# EAGLE design Emat_300v (EAGLE 9.2.2)
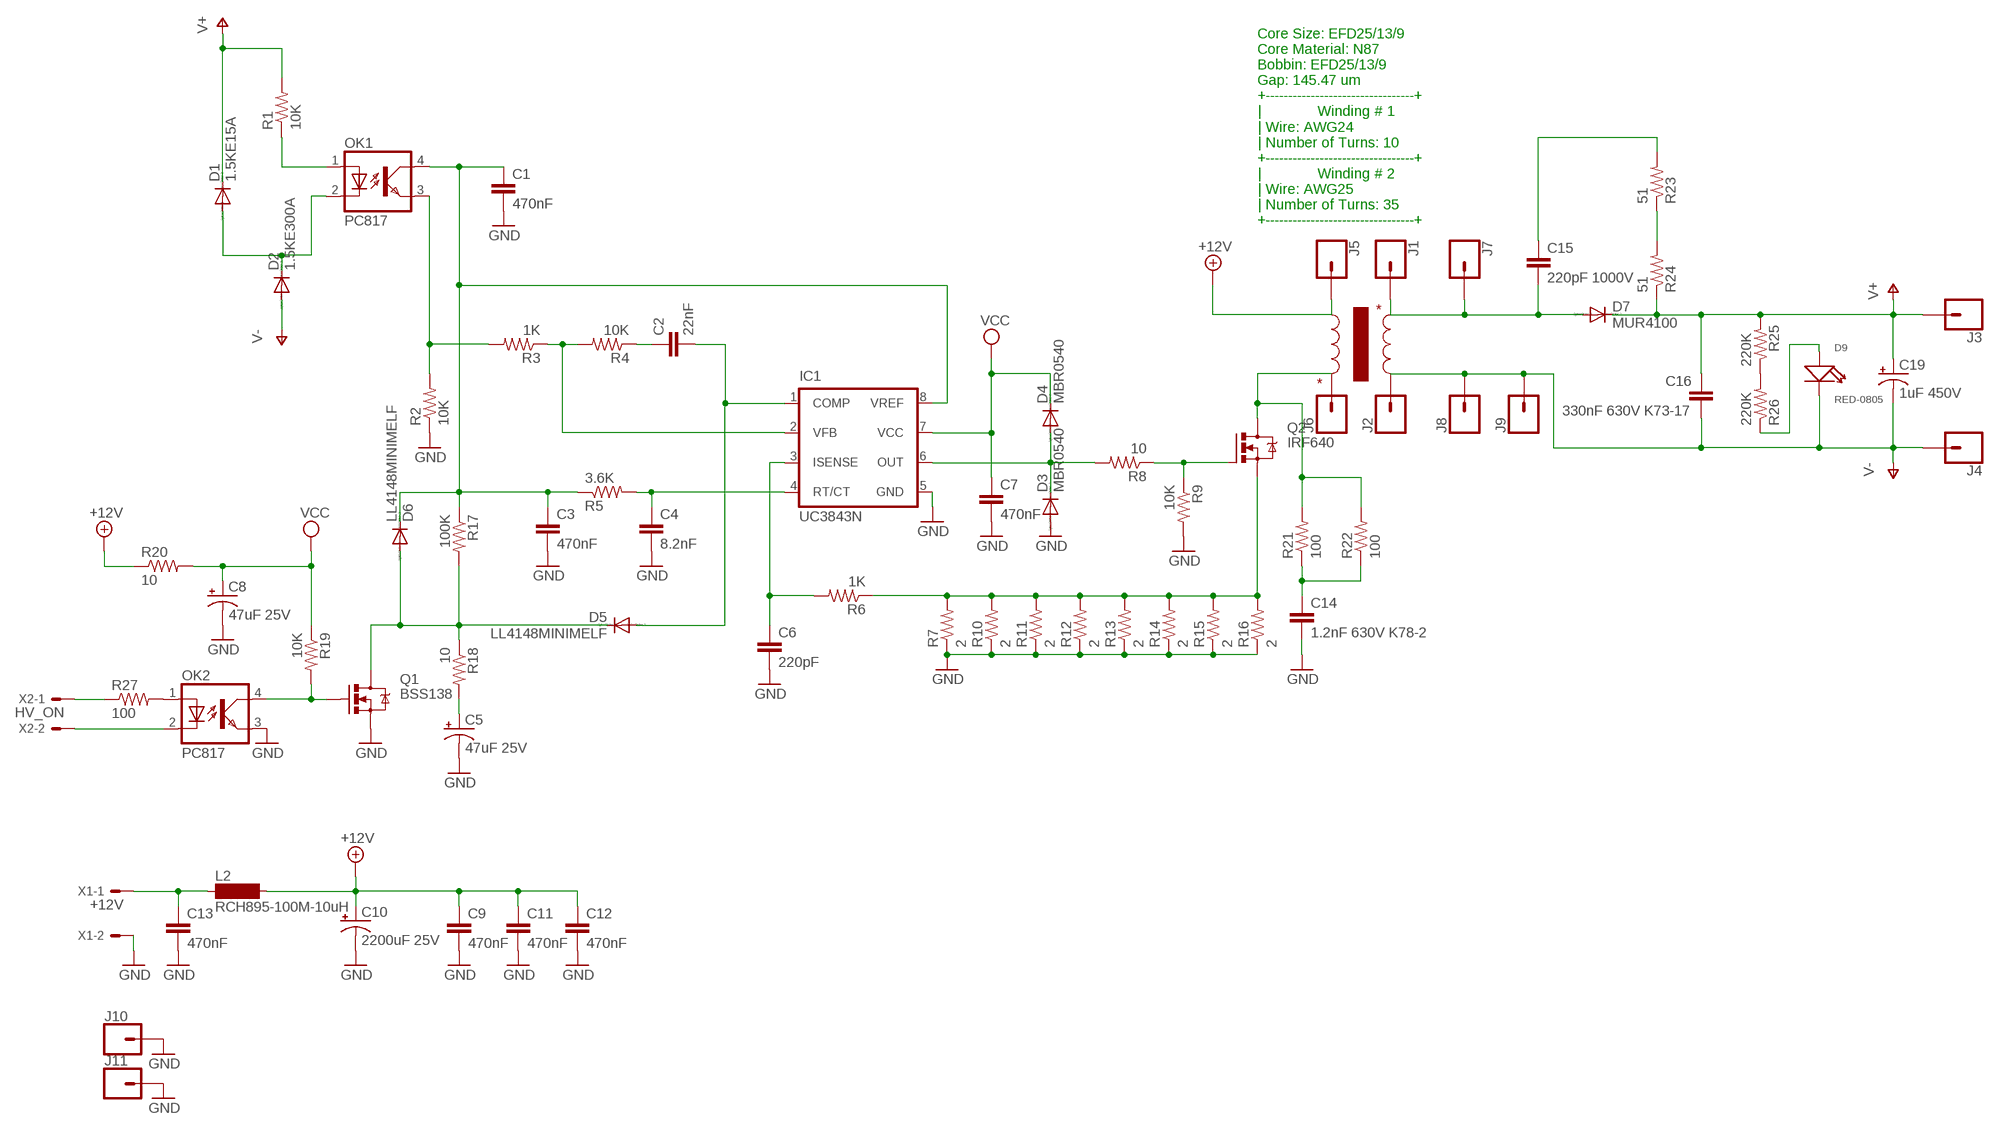
[diagram p0: schematic, sheet 1]

## Parts
C1  470nF  C-EUC0805  [C0805]
C2  22nF  C-EUC0805  [C0805]
C3  470nF  C-EUC0805  [C0805]
C4  8.2nF  C-EUC0805  [C0805]
C5  47uF 25V  CPOL-USE5-8.5  [E5-8,5]
C6  220pF  C-EUC0805  [C0805]
C7  470nF  C-EUC0805  [C0805]
C8  47uF 25V  CPOL-USE5-8.5  [E5-8,5]
C9  470nF  C-EUC0805  [C0805]
C10  2200uF 25V  CPOL-USE7.5-18  [E7,5-18]
C11  470nF  C-EUC0805  [C0805]
C12  470nF  C-EUC0805  [C0805]
C13  470nF  C-EUC0805  [C0805]
C14  1.2nF 630V K78-2  C-EU150-064X183  [C150-064X183]
C15  220pF 1000V  C-EU075-042X103  [C075-042X103]
C16  330nF 630V K73-17  C-EU225-062X268  [C225-062X268]
C19  1uF 450V  CPOL-USE5-8.5  [E5-8,5]
D1  1.5KE15A  DIODE-DO201-15  [DO201-15]
D2  1.5KE300A  DIODE-DO201-15  [DO201-15]
D3  MBR0540  DIODE-SOD123  [SOD123]
D4  MBR0540  DIODE-SOD123  [SOD123]
D5  LL4148MINIMELF  [MINIMELF]
D6  LL4148MINIMELF  [MINIMELF]
D7  MUR4100  DIODE-DO201-15  [DO201-15]
D9  RED-0805  SMD-LED-CLEAR-GREEN(0805)  [LED-0805]
IC1  UC3843N  [DIL08]
J1  CONN_01PTH_NO_SILK_KIT  [1X01NS_KIT]
J2  CONN_01PTH_NO_SILK_KIT  [1X01NS_KIT]
J3  CONN_01PTH_NO_SILK_KIT  [1X01NS_KIT]
J4  CONN_01PTH_NO_SILK_KIT  [1X01NS_KIT]
J5  CONN_01PTH_NO_SILK_KIT  [1X01NS_KIT]
J6  CONN_01PTH_NO_SILK_KIT  [1X01NS_KIT]
J7  CONN_01PTH_NO_SILK_KIT  [1X01NS_KIT]
J8  CONN_01PTH_NO_SILK_KIT  [1X01NS_KIT]
J9  CONN_01PTH_NO_SILK_KIT  [1X01NS_KIT]
J10  CONN_01PTH_NO_SILK_KIT  [1X01NS_KIT]
J11  CONN_01PTH_NO_SILK_KIT  [1X01NS_KIT]
L2  RCH895-100M-10uH  RCH-89511  [BS11]
OK1  PC817  [DIL04]
OK2  PC817  [DIL04]
Q1  BSS138  MOSFET-NCHANNELBSS138  [SOT23-3]
Q2  IRF640  [TO220BV]
R1  10K  R-US_R1206  [R1206]
R2  10K  R-US_R1206  [R1206]
R3  1K  R-US_R1206  [R1206]
R4  10K  R-US_R1206  [R1206]
R5  3.6K  R-US_R1206  [R1206]
R6  1K  R-US_R1206  [R1206]
R7  2  R-US_R1206  [R1206]
R8  10  R-US_R1206  [R1206]
R9  10K  R-US_R1206  [R1206]
R10  2  R-US_R1206  [R1206]
R11  2  R-US_R1206  [R1206]
R12  2  R-US_R1206  [R1206]
R13  2  R-US_R1206  [R1206]
R14  2  R-US_R1206  [R1206]
R15  2  R-US_R1206  [R1206]
R16  2  R-US_R1206  [R1206]
R17  100K  R-US_R1206  [R1206]
R18  10  R-US_R1206  [R1206]
R19  10K  R-US_R1206  [R1206]
R20  10  R-US_R1206  [R1206]
R21  100  R-US_R2512  [R2512]
R22  100  R-US_R2512  [R2512]
R23  51  R-US_R1206  [R1206]
R24  51  R-US_R1206  [R1206]
R25  220K  R-US_R1206  [R1206]
R26  220K  R-US_R1206  [R1206]
R27  100  R-US_R1206  [R1206]
X1  +12V  22-23-2021  [22-23-2021]
X2  HV_ON  22-23-2021  [22-23-2021]

## Nets
+12V: C9.1 C10.+ C11.1 C12.1 J5.1 L2.2 R20.1
GND: C1.2 C3.2 C4.2 C5.- C6.2 C7.2 C8.- C9.2 C10.- C11.2 C12.2 C13.2 C14.2 D3.A IC1.5(GND) J10.1 J11.1 OK2.3(EMIT) Q1.2(S) R2.1 R7.1 R9.2 R10.1 R11.1 R12.1 R13.1 R14.1 R15.1 R16.1 X1.2
N$1: D1.A D2.C OK1.2(C)
N$2: R25.1 R26.2
N$3: OK1.1(A) R1.1
N$4: C5.+ R18.2
N$5: OK1.3(EMIT) R2.2 R3.2
N$6: IC1.2(VFB) R3.1 R4.2
N$7: C2.1 R4.1
N$8: C2.2 D5.A IC1.1(COMP)
N$9: C4.1 IC1.4(RT/CT) R5.2
N$10: C6.1 IC1.3(ISENSE) R6.2
N$11: D3.C D4.A IC1.6(OUT) R8.2
N$12: Q2.G R8.1 R9.1
N$13: Q2.S R6.1 R7.2 R10.2 R11.2 R12.2 R13.2 R14.2 R15.2 R16.2
N$14: C1.1 C3.1 D6.C IC1.8(VREF) OK1.4(COL) R5.1 R17.1
N$15: D5.C D6.A Q1.3(D) R17.2 R18.1
N$16: C13.1 L2.1 X1.1
N$17: OK2.4(COL) Q1.1(G) R19.2
N$18: OK2.1(A) R27.2
N$19: OK2.2(C) X2.2
N$20: J6.1 Q2.D R21.2 R22.2
N$21: C14.1 R21.1 R22.1
N$22: C15.2 D7.A J1.1 J7.1
N$23: R27.1 X2.1
N$24: R23.1 R24.2
N$25: C15.1 R23.2
N$27: D9.+ R26.1
V+: C16.1 C19.+ D1.C D7.C J3.1 R1.2 R24.1 R25.2
V-: C16.2 C19.- D2.A D9.- J2.1 J4.1 J8.1 J9.1
VCC: C7.1 C8.+ D4.C IC1.7(VCC) R19.1 R20.2

## Notes on the sheet
- Core Size: EFD25/13/9
  Core Material: N87
  Bobbin: EFD25/13/9
  Gap: 145.47 um
  +---------------------------------+
  |              Winding # 1             
  | Wire: AWG24
  | Number of Turns: 10
  +---------------------------------+
  |              Winding # 2             
  | Wire: AWG25
  | Number of Turns: 35
  +---------------------------------+
- *
- *

## Library data of the parts
C1-C4 C6 C7 C9 C11-C16 = rcl:C-EU: CAPACITOR, European symbol
C5 C8 C10 C19 = rcl:CPOL-US: POLARIZED CAPACITOR, American symbol
D1-D4 D7 = diode:DIODE-: DIODE
D5 D6 = diode:LL4148: DIODE high speed (Philips)
D9 = Seeed-LED:SMD-LED-CLEAR-GREEN(0805): 304090057; MPN: 17-215SYGC/S530-E2/TR8; VALUE: GREEN-0805
IC1 = v-reg:UC384*: SMPS Controller Source: http://www.fairchildsemi.com/ds/UC/UC3843.pdf
J1-J11 = SparkFun-Connectors:CONN_01: Single connection point. Often used as Generic Header-pin footprint for 0.1 inch spaced/style header connections On any of the 0.1 inch spaced packages, you can populate with these: Break Away Headers - Straight <https://www.sparkfun.com/products/116> (PRT-00116) Break Away Male Headers - Right Angle <https://www.sparkfun.com/products/553> (PRT-00553) Female Headers <https://www.sparkfun.com/products/115> (PRT-00115) Break Away Headers - Machine Pin <https://www.sparkfun.com/products/117> (PRT-00117) Break Away Female Headers - Swiss Machine Pin <https://www.sparkfun.com/products/743> (PRT-00743) This device is also useful as a general connection point to wire up your design to another part of your project. Our various solder wires solder well into these plated through hole pads. Hook-Up Wire - Assortment (Stranded, 22 AWG) <https://www.sparkfun.com/products/11375> (PRT-11375) Hook-Up Wire - Assortment (Solid Core, 22 AWG) <https://www.sparkfun.com/products/11367> (PRT-11367) View the entire wire category on our website here <https://www.sparkfun.com/categories/141> Special notes: SMTSO-256-ET is a "flush mount" nut for a 4-40 screw. We mostly use this on specialty testbeds; it is a nice way to connect hardware to your PCB at an adjustable hieght. Also note, the SNAP packages are for using a snappable style connector. We sell a baggie of snaps and they are also used on two LilyPad designs: Snap Assortment - 30 pack (male and female) <https://www.sparkfun.com/products/11347> (DEV-11347) LilyPad Arduino SimpleSnap <https://www.sparkfun.com/products/10941> (DEV-10941) LilyPad SimpleSnap Protoboard <https://www.sparkfun.com/products/10940> (DEV-10940)
L2 = inductor-neosid:RCH-895: INDUCTOR nominal inductance, magnetically screened; OC_FARNELL: unknown; OC_NEWARK: unknown
OK1 OK2 = optocoupler:PC817: SHARP OPTO COUPLER; MPN: PC817X4J000F; OC_FARNELL: 9707727; OC_NEWARK: 97K7059
Q1 = SparkFun-DiscreteSemi:MOSFET-NCHANNEL: Common NMOSFET Parts MFG P/N Store ID Prod ID FDD8780 TRANS-09984 SI7820DN TRANS-11055 FDS6630A IC-08089 2N7002PW TRANS-11151 FQP30N06L COM-10213 TRANS-10060 BSS123LT1G TRANS-08345 BSS138 TRANS-00830 BS170 2N7000; PROD_ID: TRANS-00830; VALUE: 200mA/50V
Q2 = transistor-power:IRF640: HEXFET Power MOSFET
R1-R27 = resistor:R-US_: RESISTOR, American symbol
X1 X2 = con-molex:22-23-2021: .100" (2.54mm) Center Header - 2 Pin; MF: MOLEX; MPN: 22-23-2021; OC_FARNELL: 1462926; OC_NEWARK: 25C3832

## Net classes
0 default: width 0.3 mm, drill 0.3 mm, clearance 0.3 mm

## Board
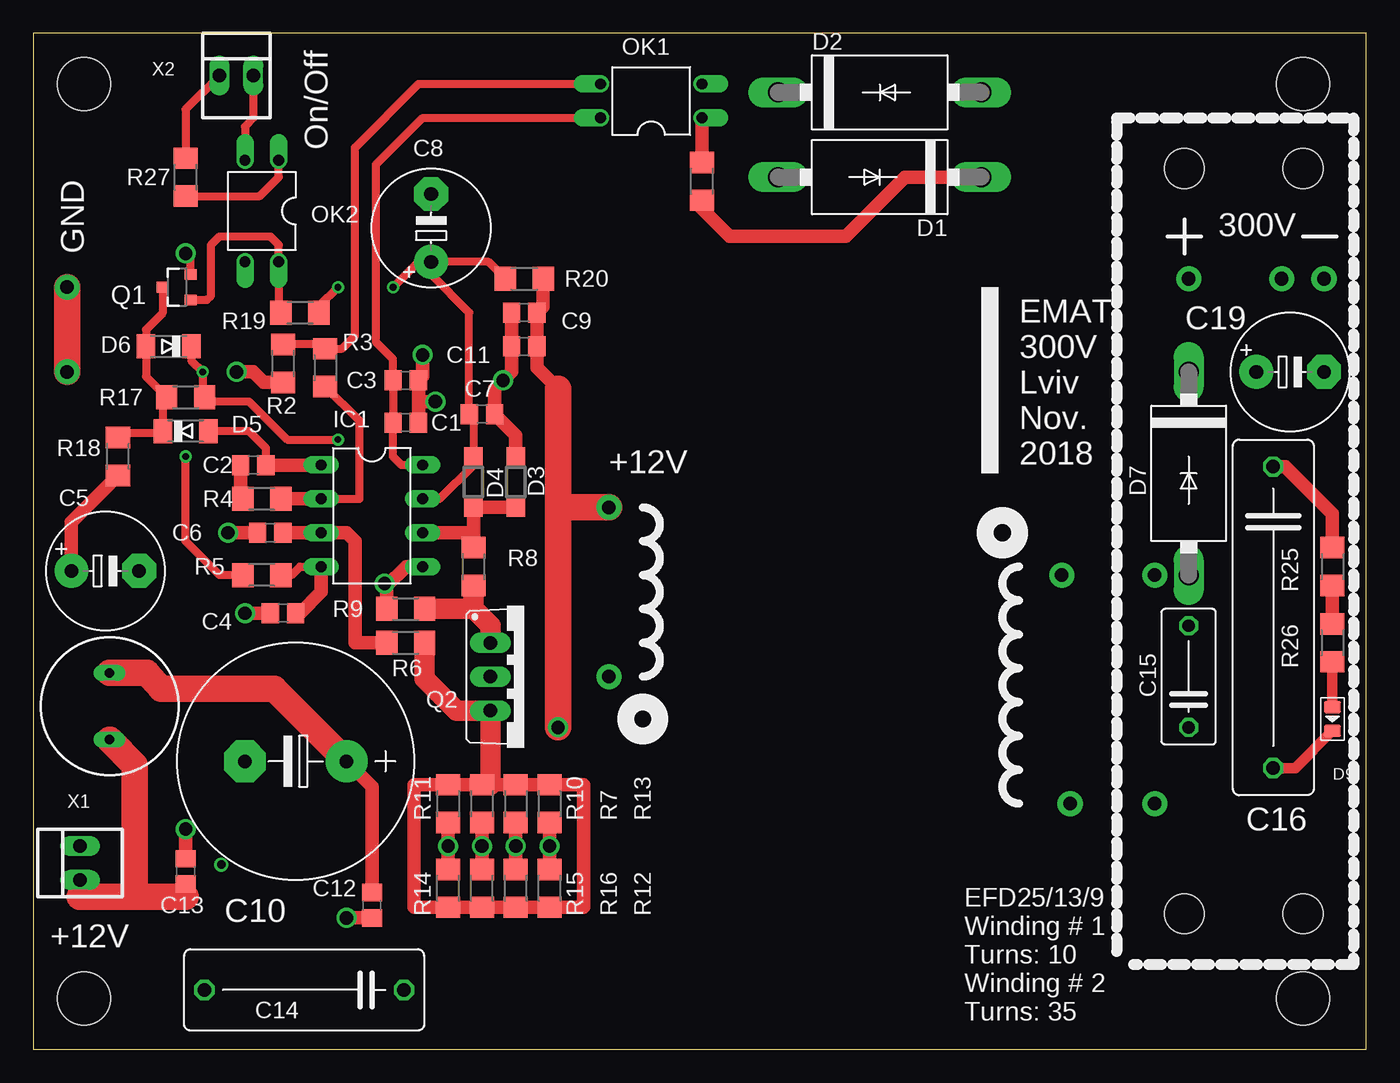
[diagram p1: board, top side]
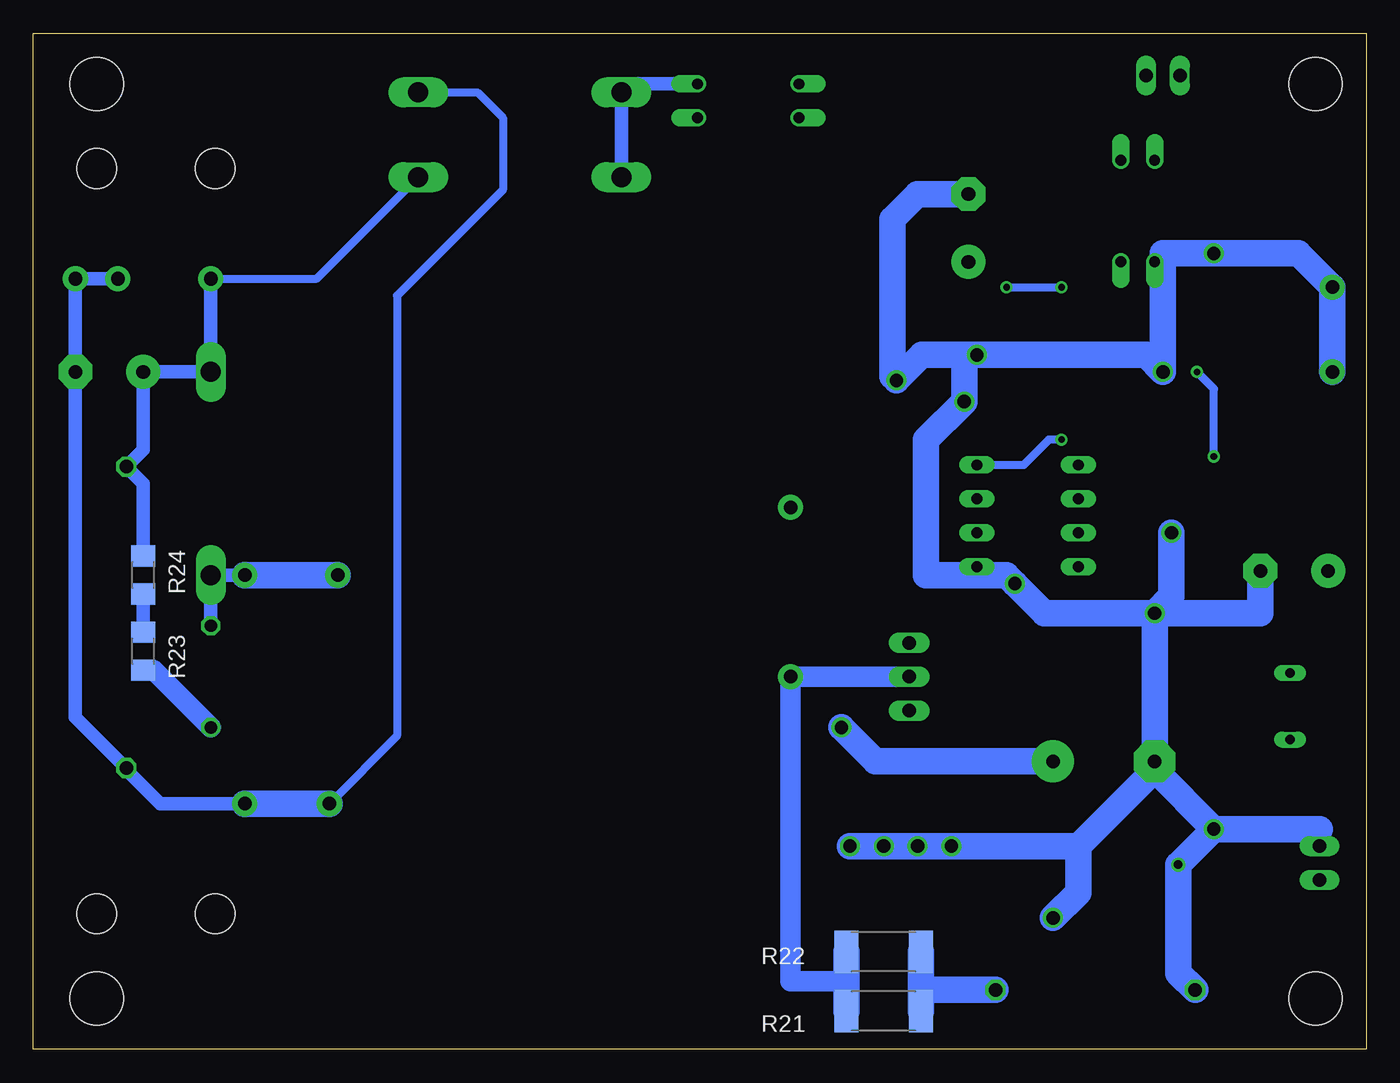
[diagram p2: board, bottom side, seen from below]

Size 100 x 76.19 mm. Coordinates in mm from the lower left corner, seen from the top.
Outline: 0,0 100,0 100,76.19 0,76.19 0,0
Copper layers (1*16): Top 0.035mm / dielectric 1.5mm / Bottom 0.035mm
Design rules "default *": minimum track width 10mil, minimum drill 25mil, track to track 20mil, track to pad 20mil, pad to pad 8mil, via to via 8mil, smd to smd 8mil, copper to edge 40mil, drill to drill 8mil, minimum pad ring 10mil, minimum via ring 8mil, stop-mask expansion 4mil, vias tented up to drill 0mil, thermal gap 10mil
Holes 4 mm at 95.25,72.39 95.25,3.81 3.81,3.81 3.81,72.39
Holes 3 mm at 95.25,10.16 86.36,10.16 95.25,66.04 86.36,66.04

### Footprints (pad centres in the part's own frame; a part is rotated, then mirrored left to right if it is on the bottom)
C0805 = smd 1.3 x 1.5: 1 -0.95,0; 2 0.95,0
E5-8,5 = drill 1.016 pad 2.54: + -2.54,0 | drill 1.016 pad 2.54 octagon: - 2.54,0
E7,5-18 = drill 1.016 pad 3.15: + -3.81,0 | drill 1.016 pad 3.15 octagon: - 3.81,0
C150-064X183 = drill 1.016 octagon: 1 -7.493,0; 2 7.493,0
C075-042X103 = drill 0.914 octagon: 1 -3.81,0; 2 3.81,0
C225-062X268 = drill 1.016 octagon: 1 -11.303,0; 2 11.303,0
DO201-15 = drill 1.499 long: A 7.62,0; C -7.62,0
SOD123 = smd 1.4 x 1.4: A 1.9,0; C -1.9,0
MINIMELF = smd 1.4 x 1.8: A 1.7,0; C -1.7,0
LED-0805 = smd 0.889 x 1.27: + -0.889,0; - 0.889,0
DIL08 = drill 0.813 long: 1 -3.81,-3.81; 2 -1.27,-3.81; 3 1.27,-3.81; 4 3.81,-3.81; 5 3.81,3.81; 6 1.27,3.81; 7 -1.27,3.81; 8 -3.81,3.81
1X01NS_KIT = drill 1.016 pad 1.88: 1 0,0
BS11 = drill 0.7 long: 1 -2.5,0; 2 2.5,0
DIL04 = drill 0.813 offset: 1 -1.27,-3.81; 2 1.27,-3.81; 3 1.27,3.81; 4 -1.27,3.81
SOT23-3 = smd 0.8 x 0.9: 1 -0.95,-1; 2 0.95,-1; 3 0,1.1
TO220BV = drill 1.016 long: D 0,-2.54; G -2.54,-2.54; S 2.54,-2.54
R1206 = smd 1.6 x 1.803: 1 -1.422,0; 2 1.422,0
R2512 = smd 1.8 x 3.2: 1 -2.8,0; 2 2.8,0
22-23-2021 = drill 1 long: 1 -1.27,0; 2 1.27,0

### Placement (x,y rotation side)
C1  27.94,46.99 0 top
C2  16.51,43.81 0 top
C3  27.94,50.16 0 top
C4  18.73,32.7 180 top
C5  5.4,35.88 0 top
C6  17.78,38.73 180 top
C7  33.66,47.62 0 top
C8  29.84,61.59 90 top
C9  36.83,55.24 180 top
C10  19.68,21.59 180 top
C11  36.83,52.7 180 top
C12  25.4,10.79 270 top
C13  11.43,13.34 90 top
C14  20.32,4.45 180 top
C15  86.68,27.94 90 top
C16  93.03,32.38 270 top
C19  94.3,50.8 0 top
D1  63.5,65.41 180 top
D2  63.5,71.75 0 top
D3  36.2,42.55 90 top
D4  33.02,42.55 270 top
D5  11.43,46.35 0 top
D6  10.16,52.7 180 top
D7  86.68,43.18 270 top
D9  97.47,24.77 270 top
IC1  25.4,40.01 270 top
J1  77.15,35.56 0 top
J2  77.79,18.41 0 top
J3  86.68,57.78 0 top
J4  96.84,57.78 0 top
J5  43.18,40.64 0 top
J6  43.18,27.94 0 top
J7  84.14,35.56 0 top
J8  84.14,18.41 0 top
J9  93.66,57.78 0 top
J10  2.54,50.8 0 top
J11  2.54,57.15 0 top
L2  5.71,25.72 90 top
OK1  46.35,71.12 90 top
OK2  17.14,62.87 180 top
Q1  10.79,57.15 90 top
Q2  36.83,27.94 270 top
R1  50.16,65.09 270 top
R2  18.73,51.44 90 top
R3  21.91,51.12 90 top
R4  17.14,41.27 0 top
R5  17.14,35.56 0 top
R6  27.94,30.48 180 top
R7  36.2,18.41 90 top
R8  33.02,36.2 90 top
R9  27.94,33.02 180 top
R10  33.66,18.41 90 top
R11  31.11,18.41 90 top
R12  38.73,12.06 270 top
R13  38.73,18.41 90 top
R14  31.11,12.06 270 top
R15  33.66,12.06 270 top
R16  36.2,12.06 270 top
R17  11.43,48.9 180 top
R18  6.35,44.45 270 top
R19  20,55.24 180 top
R20  36.83,57.78 180 top
R21  36.2,2.86 180 bottom
R22  36.2,7.3 180 bottom
R23  91.76,29.84 270 bottom
R24  91.76,35.56 270 bottom
R25  97.47,36.2 90 top
R26  97.47,30.48 90 top
R27  11.43,65.41 270 top
X1  3.49,13.97 90 top
X2  15.24,73.03 0 top

### Tracks (layer width: path | path; a pad name or v marks a point on that pad's centre or on a via)
+12V  (via drill 1)
  Top 1: 39.37,49.53 37.78,51.12 C11.1 C9.1 38.25,55.72 R20.1
  Top 1.016: C12.1 25.4,19.68 C10.+
  Top 2: L2.2 8.52,28.22 9.61,27.03 18.06,27.03 C10.+ | v39.37,24.13 39.37,40.64 | 39.37,40.64 39.37,49.53 | 39.37,40.64 J5.1
  Bottom 2: C10.+ 36.83,21.59 v39.37,24.13
GND  (via drill 0.64, 1)
  Top 0.61: Q1.2 11.79,59.33 v11.43,59.69
  Top 1: C9.2 C11.2 35.88,50.8 v35.24,50.16 34.6,49.53 C7.2 36.2,46.03 D3.A | C1.2 C3.2 29.21,50.48 v29.21,52.07 | R2.1 17.3,50.01 16.51,50.8 v15.24,50.8 | R11.1 v31.11,15.24 R14.1 | R10.1 v33.66,15.24 R15.1 | R7.1 v36.2,15.24 R16.1 | R13.1 v38.73,15.24 R12.1
  Top 1.016: v11.43,16.51 C13.2 | R9.2 26.52,34.76 | 26.52,34.76 v26.35,34.92 | IC1.5 27.95,36.2 26.52,34.76 | C4.2 v15.88,32.7 | C6.2 v14.61,38.73 | v30.16,48.58 28.89,48.58 C3.2 | C12.2 v23.5,9.85 v23.5,9.84
  Top 2: J11.1 J10.1
  Bottom 0.61: OK2.3 15.24,59.05 15.24,59.69
  Bottom 1.016: X1.2 3.49,16.51
  Bottom 2: v29.21,52.07 33.34,52.07 v35.24,50.16 35.56,50.48 35.56,62.23 33.66,64.14 C8.- | v29.21,52.07 16.51,52.07 v15.24,50.8 15.24,59.05 | 21.59,15.24 v31.11,15.24 v33.66,15.24 v36.2,15.24 v38.73,15.24 | 3.49,16.51 v11.43,16.51 | v11.43,16.51 v14.1,13.84 14.1,5.71 C14.2 | v11.43,16.51 15.88,20.95 | 15.88,20.95 C10.- v15.88,32.7 | 15.88,20.95 21.59,15.24 | v15.88,32.7 24.13,32.7 v26.35,34.92 26.99,35.56 33.02,35.56 33.02,45.72 v30.16,48.58 30.16,52.07 v29.21,52.07 | v14.61,38.73 14.61,33.97 v15.88,32.7 | 21.59,15.24 21.59,11.75 v23.5,9.84 | 15.24,59.69 v11.43,59.69 5.08,59.69 J11.1 J10.1 | C5.- 7.94,32.7 v15.88,32.7
N$1
  Bottom 1.016: D1.A D2.C 55.24,72.39 OK1.2
N$2
  Top 1: R25.1 R26.2
N$3
  Top 1.016: OK1.1 R1.1
N$4
  Top 1.016: R18.2 2.86,39.53 C5.+
N$5
  Top 0.61: R2.2 21.59,52.86 R3.2 23.18,52.54 24.13,53.49 24.13,67.63 28.89,72.39 OK1.3
N$6
  Top 0.61: IC1.2 24.45,41.27 24.45,47.16 R3.1
  Top 1.016: R4.2 IC1.2
N$7
  Top 1.016: C2.1 15.56,41.44 R4.1
N$8
  Top 0.61: C2.2 17.46,45.09 16.19,46.35 D5.A
  Top 1.016: IC1.1 C2.2
N$9
  Top 0.61: R5.2 19.37,35.56 20,36.2 IC1.4
  Top 1.016: IC1.4 21.59,34.29 20,32.7 C4.1
N$10
  Top 1.016: R6.2 24.13,30.48 24.13,38.1 23.5,38.73 IC1.3 C6.1
N$11
  Top 1.016: IC1.6 33.02,38.73 R8.2 D4.A D3.C
N$12
  Top 1.524: 33.02,33.02 R8.1 | R9.1 33.02,33.02 | 33.02,33.02 34.29,31.75 Q2.G
N$13
  Top 1.016: R11.2 R10.2 34.29,19.84 R7.2 R13.2 41.27,19.84 41.27,10.64 R12.2 R16.2 R15.2 R14.2 28.57,10.64 28.57,19.84 R11.2
  Top 1.524: 34.29,19.84 Q2.S 31.75,25.4 29.36,27.79 R6.1
N$14  (via drill 0.5)
  Top 0.61: IC1.8 27.62,43.81 26.99,44.45 C1.1 C3.1 26.99,51.75 25.72,53.02 25.72,66.36 29.21,69.85 OK1.4 | R5.1 13.97,35.56 11.43,38.1 v11.43,44.45 | D6.C 11.86,51.64 v12.7,50.8 12.7,49.05 R17.1 13.17,48.58 16.19,48.58 19.05,45.72 v22.86,45.72
  Bottom 0.61: v11.43,44.45 11.43,49.53 v12.7,50.8 | v22.86,45.72 23.81,45.72 25.72,43.81 IC1.8
N$15
  Top 0.61: R18.1 6.67,46.19 9.56,46.19 D5.C 9.73,48.62 R17.2 8.46,50.44 D6.A 8.46,53.98 9.7,55.21 Q1.3
N$16
  Top 1.016: C13.1 11.43,11.43 | 3.49,11.43 X1.1
  Top 2: 11.43,11.43 7.62,11.43 | 7.62,11.43 3.49,11.43 | L2.1 7.62,21.31 7.62,11.43
N$17
  Top 0.61: Q1.1 13.02,56.2 13.34,56.52 13.34,60.33 13.97,60.96 17.78,60.96 18.41,60.33 OK2.4 18.41,55.41 R19.2
N$18
  Top 0.61: R27.2 16.99,63.98 18.41,65.41 OK2.1
N$19
  Top 0.61: OK2.2 15.88,69.22 16.51,69.85 X2.2
N$20
  Bottom 1.524: 38.99,5.08 43.18,5.08 J6.1 Q2.D
  Bottom 2: R22.2 38.99,5.08 R21.2
N$21
  Bottom 2: R22.1 33.4,5.08 | 33.4,5.08 R21.1 | C14.1 32.76,4.45 33.4,5.08
N$22
  Bottom 1: C15.2 D7.A J7.1
  Bottom 2: J7.1 J1.1
N$23
  Top 0.61: X2.1 11.43,70.48 R27.1
N$24
  Bottom 1: R24.2 R23.1
N$25
  Bottom 1.524: C15.1 90.97,28.42 R23.2
N$27
  Top 0.8: D9.+ R26.1
V+
  Top 1: R25.2 97.47,40.16 93.94,43.69 C16.1
  Top 1.016: D1.C 65.41,65.41 60.96,60.96 52.22,60.96 50.16,63.02 R1.2
  Bottom 0.61: J3.1 78.74,57.78 D1.C
  Bottom 1: J3.1 D7.C C19.+ 91.76,44.96 C16.1 91.76,42.42 R24.1
V-
  Top 0.8: D9.- 94.68,21.08 C16.2
  Bottom 0.61: D2.A 66.67,71.75 64.77,69.85 64.77,64.45 72.71,56.52 72.71,23.5 J2.1
  Bottom 1: J9.1 J4.1 C19.- 96.84,24.89 C16.2 93.03,20.95 90.49,18.41 J8.1
  Bottom 2: J2.1 J8.1
VCC  (via drill 0.5)
  Top 0.61: IC1.7 30.48,41.27 33.02,43.81 D4.C 33.02,47.31 C7.1 32.7,55.24 29.84,58.1 C8.+ | R20.2 34.14,59.05 C8.+ | C8.+ 28.89,59.05 v26.99,57.15 | v22.86,57.15 21.42,55.72 R19.1
  Bottom 0.61: v26.99,57.15 v22.86,57.15

### Text on the board
tNames: On/Off | 300V | GND | EMAT / 300V / Lviv / Nov. / 2018 | +12V | +12V | EFD25/13/9 / Winding # 1 / Turns: 10 / Winding # 2 / Turns: 35